# EasyEDA Pro project SimGEKI2_AudioPort.epro

# Schematic BackPannel_v2
Board Name: BackPannel_v2; Create Date: 2025-01-15; Page Name: P1; Project Name: ongeki-controller; Schematic Name: BackPannel_v2; Update Date: 2025-01-15; Company: 嘉立创EDA; Page Size: A4; Version: V1.0
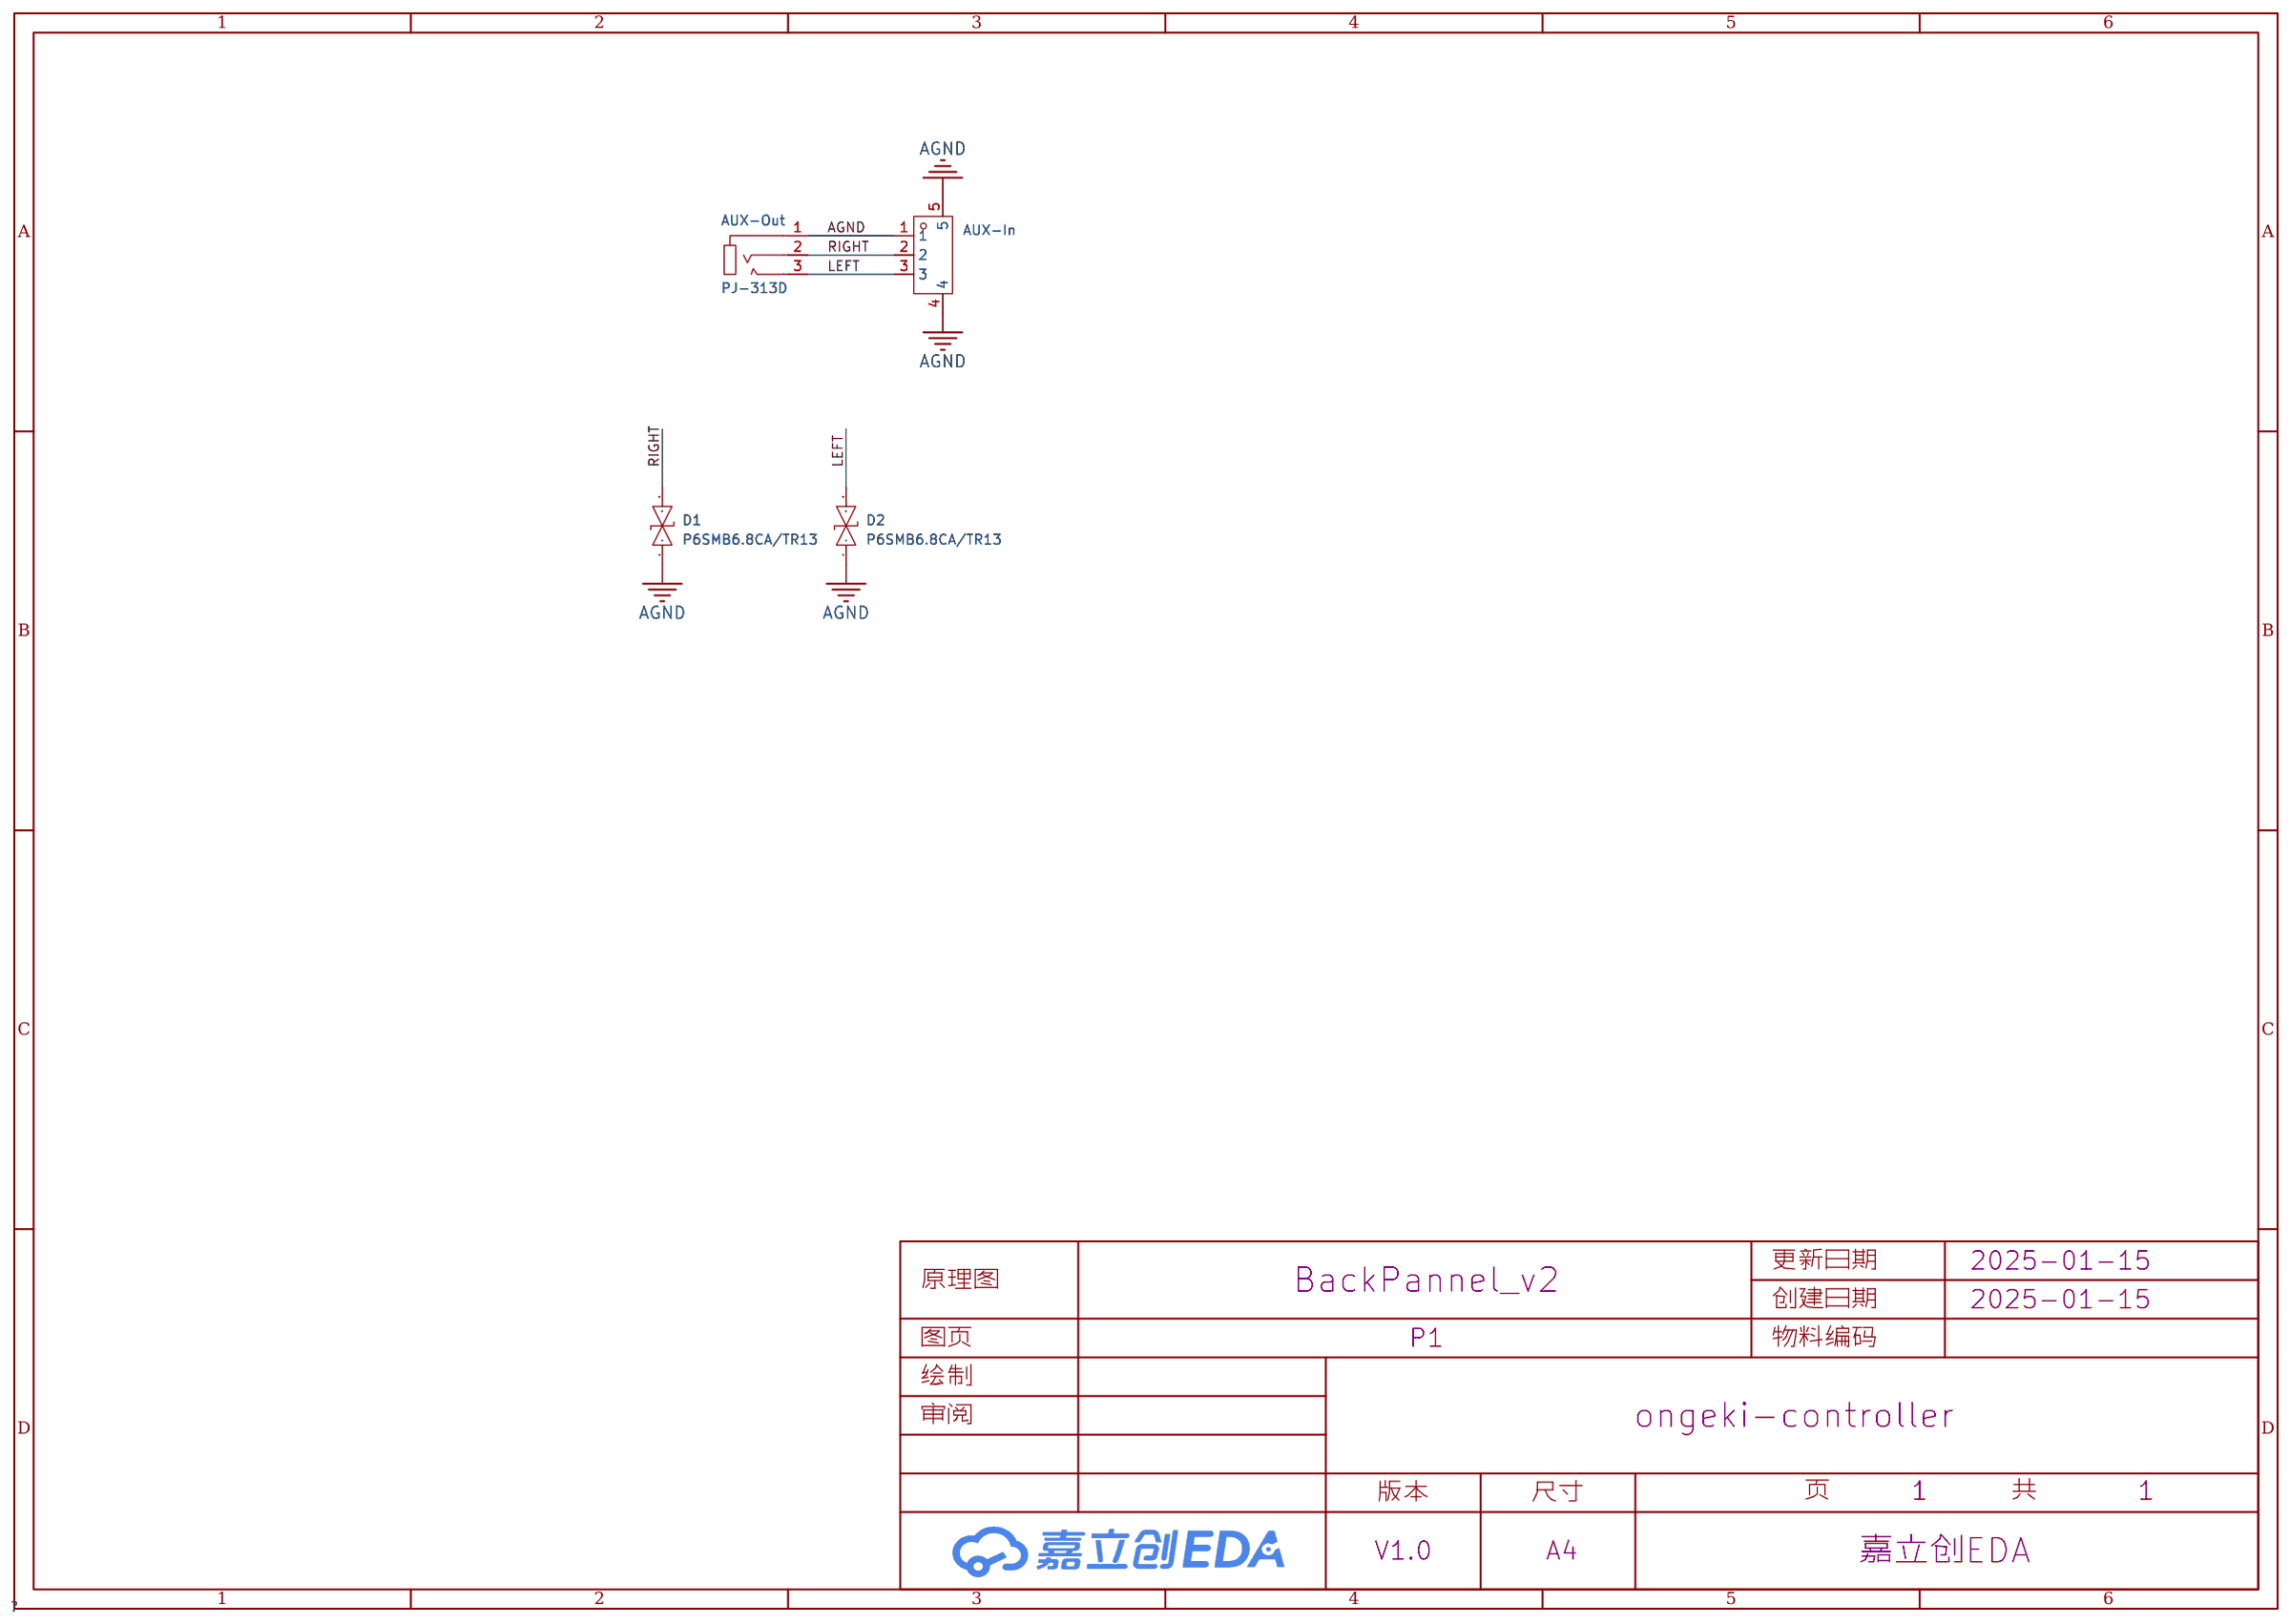
[diagram p0: schematic sheet]

## Parts
AUX-In  WAFER-PH2.0-3PWB  [CONN-SMD_3P-P2.00_XUNPU_WAFER-PH2.0-3PWB]
AUX-Out  PJ-313D  [AUDIO-SMD_PJ-313D-2]
D1  P6SMB6.8CA/TR13  [SMB_L4.6-W3.6-LS5.3-BI]
D2  P6SMB6.8CA/TR13  [SMB_L4.6-W3.6-LS5.3-BI]

## Library data of the parts
AUX-In = WAFER-PH2.0-3PWB: 插针结构:1x3P;间距:2mm;安装方式:卧贴;总PIN数:3P;排数:1;每排PIN数:3;额定电流:2A;工作温度范围:-25℃~+85℃;; LCSC Part Name: 1x3P 间距:2mm 卧贴; Supplier Part: C3029441; Manufacturer: XUNPU(讯普); Supplier Footprint: SMD,P=2mm,卧贴; JLCPCB Part Class: 扩展库; Datasheet: https://atta.szlcsc.com/upload/public/pdf/source/20220527/83903C18429EFE4C9EEE8C529A248431.pdf; Supplier: LCSC; Pins Structure: 1x3P; Pitch: 2mm; Mounting Style: 卧贴; Number of Pins: 3P; Number of Rows: 1; Number of PINs Per Row: 3; Current Rating (Max): 2A; Operating Temperature Range: -25℃~+85℃
AUX-Out = PJ-313D_C668608: 连接器类型:3.5mm耳机座;额定电流:500mA;额定电压:30V;工作温度范围:-30℃~+70℃;; LCSC Part Name: 3.5mm耳机座; Supplier Part: C668608; Manufacturer: SHOU HAN(首韩); Supplier Footprint: SMD; JLCPCB Part Class: 扩展库; Datasheet: https://atta.szlcsc.com/upload/public/pdf/source/20200618/C668608_AB2020DBBA26E8897834D328F2FA3C40.pdf; Supplier: LCSC; Connector Type: 3.5mm耳机座; Current Rating (Max): 500mA; Voltage Rating (Max): 30V; Operating Temperature Range: -30℃~+70℃
D1 D2 = P6SMB6.8CA/TR13: 反向截止电压(Vrwm):5.8V;钳位电压:10.5V;峰值脉冲电流(Ipp):58.1A;峰值脉冲功率(Ppp):600W;击穿电压:6.45V;; Supplier Part: C78395; Manufacturer: Brightking(君耀电子); Supplier Footprint: SMB(DO-214AA); JLCPCB Part Class: 基础库; Datasheet: https://atta.szlcsc.com/upload/public/pdf/source/20160709/1468031879762.pdf; Supplier: LCSC; Reverse Stand-Off Voltage (Vrwm): 5.8V; Clamping Voltage: 10.5V; Peak Pulse Current (Ipp): 58.1A; Peak Pulse Power Dissipation (Ppp): 600W; Voltage - Breakdown: 6.45V; Type: TVS

## Nets
AGND: AUX-In.1 AUX-In.4 AUX-In.5 AUX-Out.1 D1.1 D2.1
LEFT: AUX-In.3 AUX-Out.3 D2.2
RIGHT: AUX-In.2 AUX-Out.2 D1.2

# Board BackPannel_v2
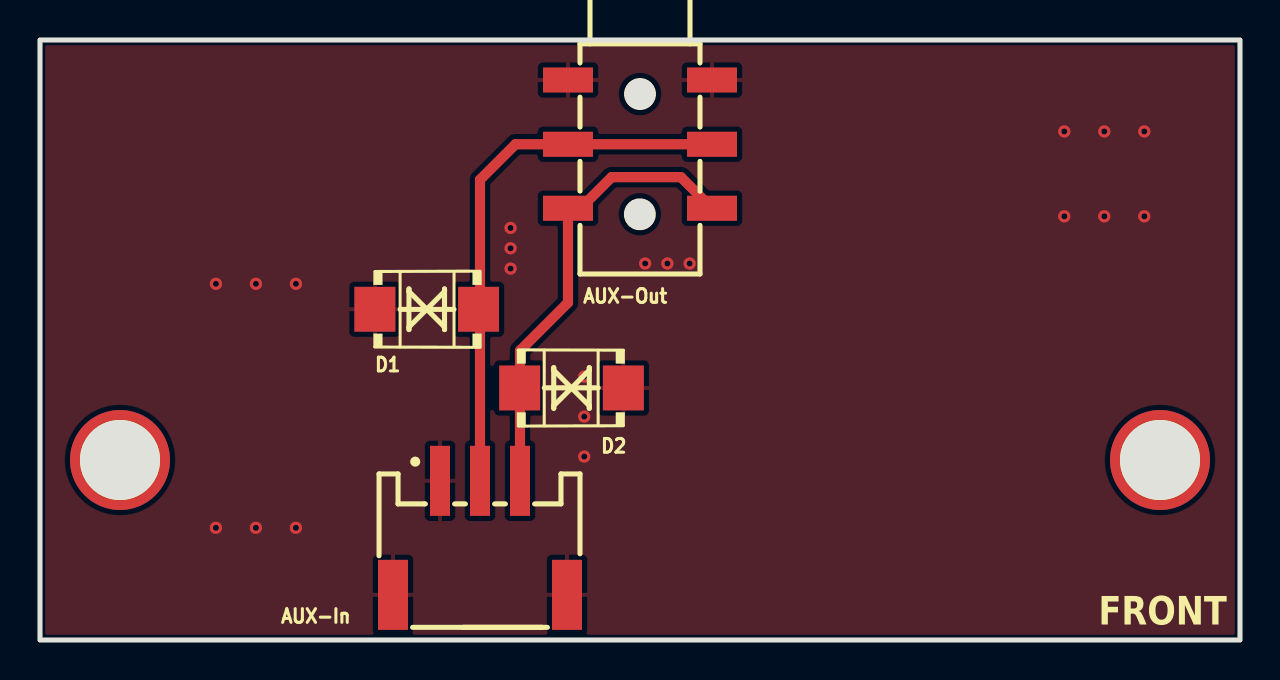
[diagram p1: board, top side]
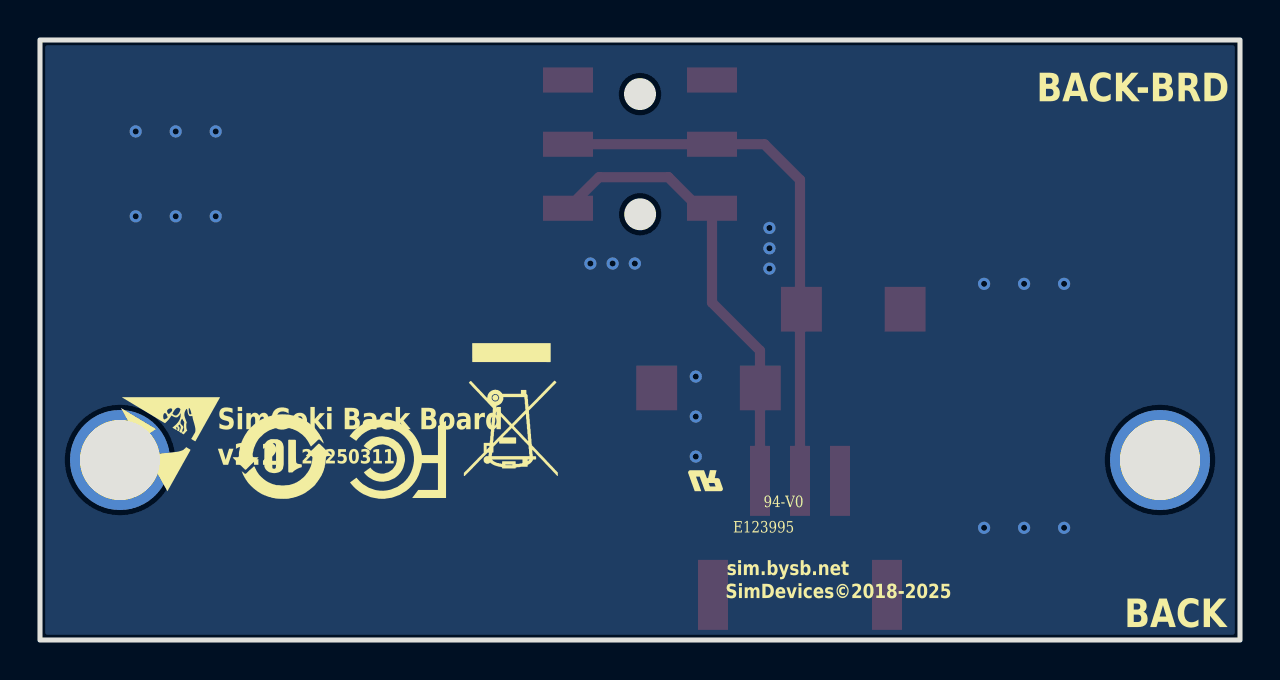
[diagram p2: board, bottom side, seen from below]

Outline 60 x 30 mm; copper layers: Top Layer, Bottom Layer. Coordinates in mm from the lower left corner of the outline.
Outline path: rectangle 0,30 60,0
Stack: Top Layer 0.035mm / Dielectric1 1.51mm FR4 er 4.5 / Bottom Layer 0.035mm

## Design rules (mm)
template: JLCPCB Capability(Two Layers Board)
spacing copperThickness1oz (default): track to track 0.102, other pairs 0.152 to 0.3
spacing copperThickness2oz: track to track 0.203, other pairs 0.152 to 0.3
track width copperThickness1oz (default): min 0.127, default 0.254, max 2.54
track width copperThickness2oz: min 0.203, default 0.254, max 2.54
differential pair differentialPair (default): width min 0.127, default 0.254, max 2.54; gap min 0.152, default 0.152
via viaSize (default): diameter min 0.5, default 0.61, max 10; hole min 0.3, default 0.305, max 6.3

## Placement (name value [footprint] x y rotation side)
AUX-In  WAFER-PH2.0-3PWB  [CONN-SMD_3P-P2.00_XUNPU_WAFER-PH2.0-3PWB]  22 5.11 0 top
AUX-Out  PJ-313D  [AUDIO-SMD_PJ-313D-2]  30 24.79 0 top
D1  P6SMB6.8CA/TR13  [SMB_L4.6-W3.6-LS5.3-BI]  19.34 16.54 0 top
D2  P6SMB6.8CA/TR13  [SMB_L4.6-W3.6-LS5.3-BI]  26.58 12.6 180 top
NOREF  -  [Pad_e490]  4 9 0 top
NOREF#2  -  [Pad_e492]  56 9 0 top

## Footprints (pads in the part's own frame, mm; a bottom-side part is the same pattern mirrored in y, then rotated)
AUDIO-SMD_PJ-313D-2
  rect 2.5x1.25 smd: 1(-3.6,3.205) 1(3.6,3.205) 2(-3.6,-0.005) 2(3.6,-0.005) 3(-3.6,-3.205) 3(3.6,-3.205)
CONN-SMD_3P-P2.00_XUNPU_WAFER-PH2.0-3PWB
  rect 1x3.5 smd: 1(-2,2.85) 2(0,2.85) 3(2,2.85)
  rect 1.5x3.5 smd: 4(4.35,-2.85) 5(-4.35,-2.85)
Pad_e490
  round 5 hole 4: 15(0,0)
Pad_e492
  round 5 hole 4: 15(0,0)
SMB_L4.6-W3.6-LS5.3-BI
  rect 2.047x2.241 smd: 1(-2.591,0) 2(2.591,0)

## Nets
As in the schematic.

Pads without a net: NOREF 15; NOREF#2 15

## Via types
v1: diameter 0.61, hole 0.305, Top Layer to Bottom Layer, 21 vias

## Routing (per net, layer and track width the routed paths; a pad name or vN(x,y) marks a point on that pad's centre or on a via; arc(x,y) is an arc through that point)
AGND:
  vias: v1(8.8,17.81) v1(8.8,5.61) v1(10.8,17.81) v1(10.8,5.61) v1(12.8,17.81) v1(12.8,5.61) v1(23.53,20.6) v1(23.53,19.59) v1(23.53,18.57) v1(27.21,13.17) v1(27.21,11.17) v1(27.21,9.17) v1(30.26,18.82) v1(31.37,18.82) v1(32.48,18.82) v1(51.21,25.43) v1(51.21,21.18) v1(53.21,25.43) v1(53.21,21.18) v1(55.21,25.43) v1(55.21,21.18)
LEFT: length 23.1
  Top Layer w0.508: AUX-In.3 24,14.47 26.4,16.87 AUX-Out.3 27.03,21.59 28.58,23.14 32.05,23.14 AUX-Out.3
RIGHT: length 26.7
  Top Layer w0.508: AUX-In.2 22,23.01 23.78,24.79 25.73,24.79 ; AUX-Out.2 AUX-Out.2

## Copper pours and planes (outline as drawn; the poured copper is in the pictures)
AGND on Top Layer: 0,30 60,30 60,0 0,0
AGND on Bottom Layer: 0,30 60,30 60,0 0,0

## Text on the board
Bottom Silkscreen Layer: sim.bysb.net | SimDevices©2018-2025 | 20250311 | SimGeki Back Board | v2.2 | BACK-BRD | BACK | 94-V0 | E123995
Top Solder Mask Layer: SimGeki | Back Board
Top Silkscreen Layer: JLCJLCJLCJLC | FRONT
